# EasyEDA schematic SCH_Control_unit.json
TITLE: Sheet_1; REV: 1.0; Date: 2025-07-28; Sheet: 1/1; Drawn By: ElectroVerse; Company: Your Company
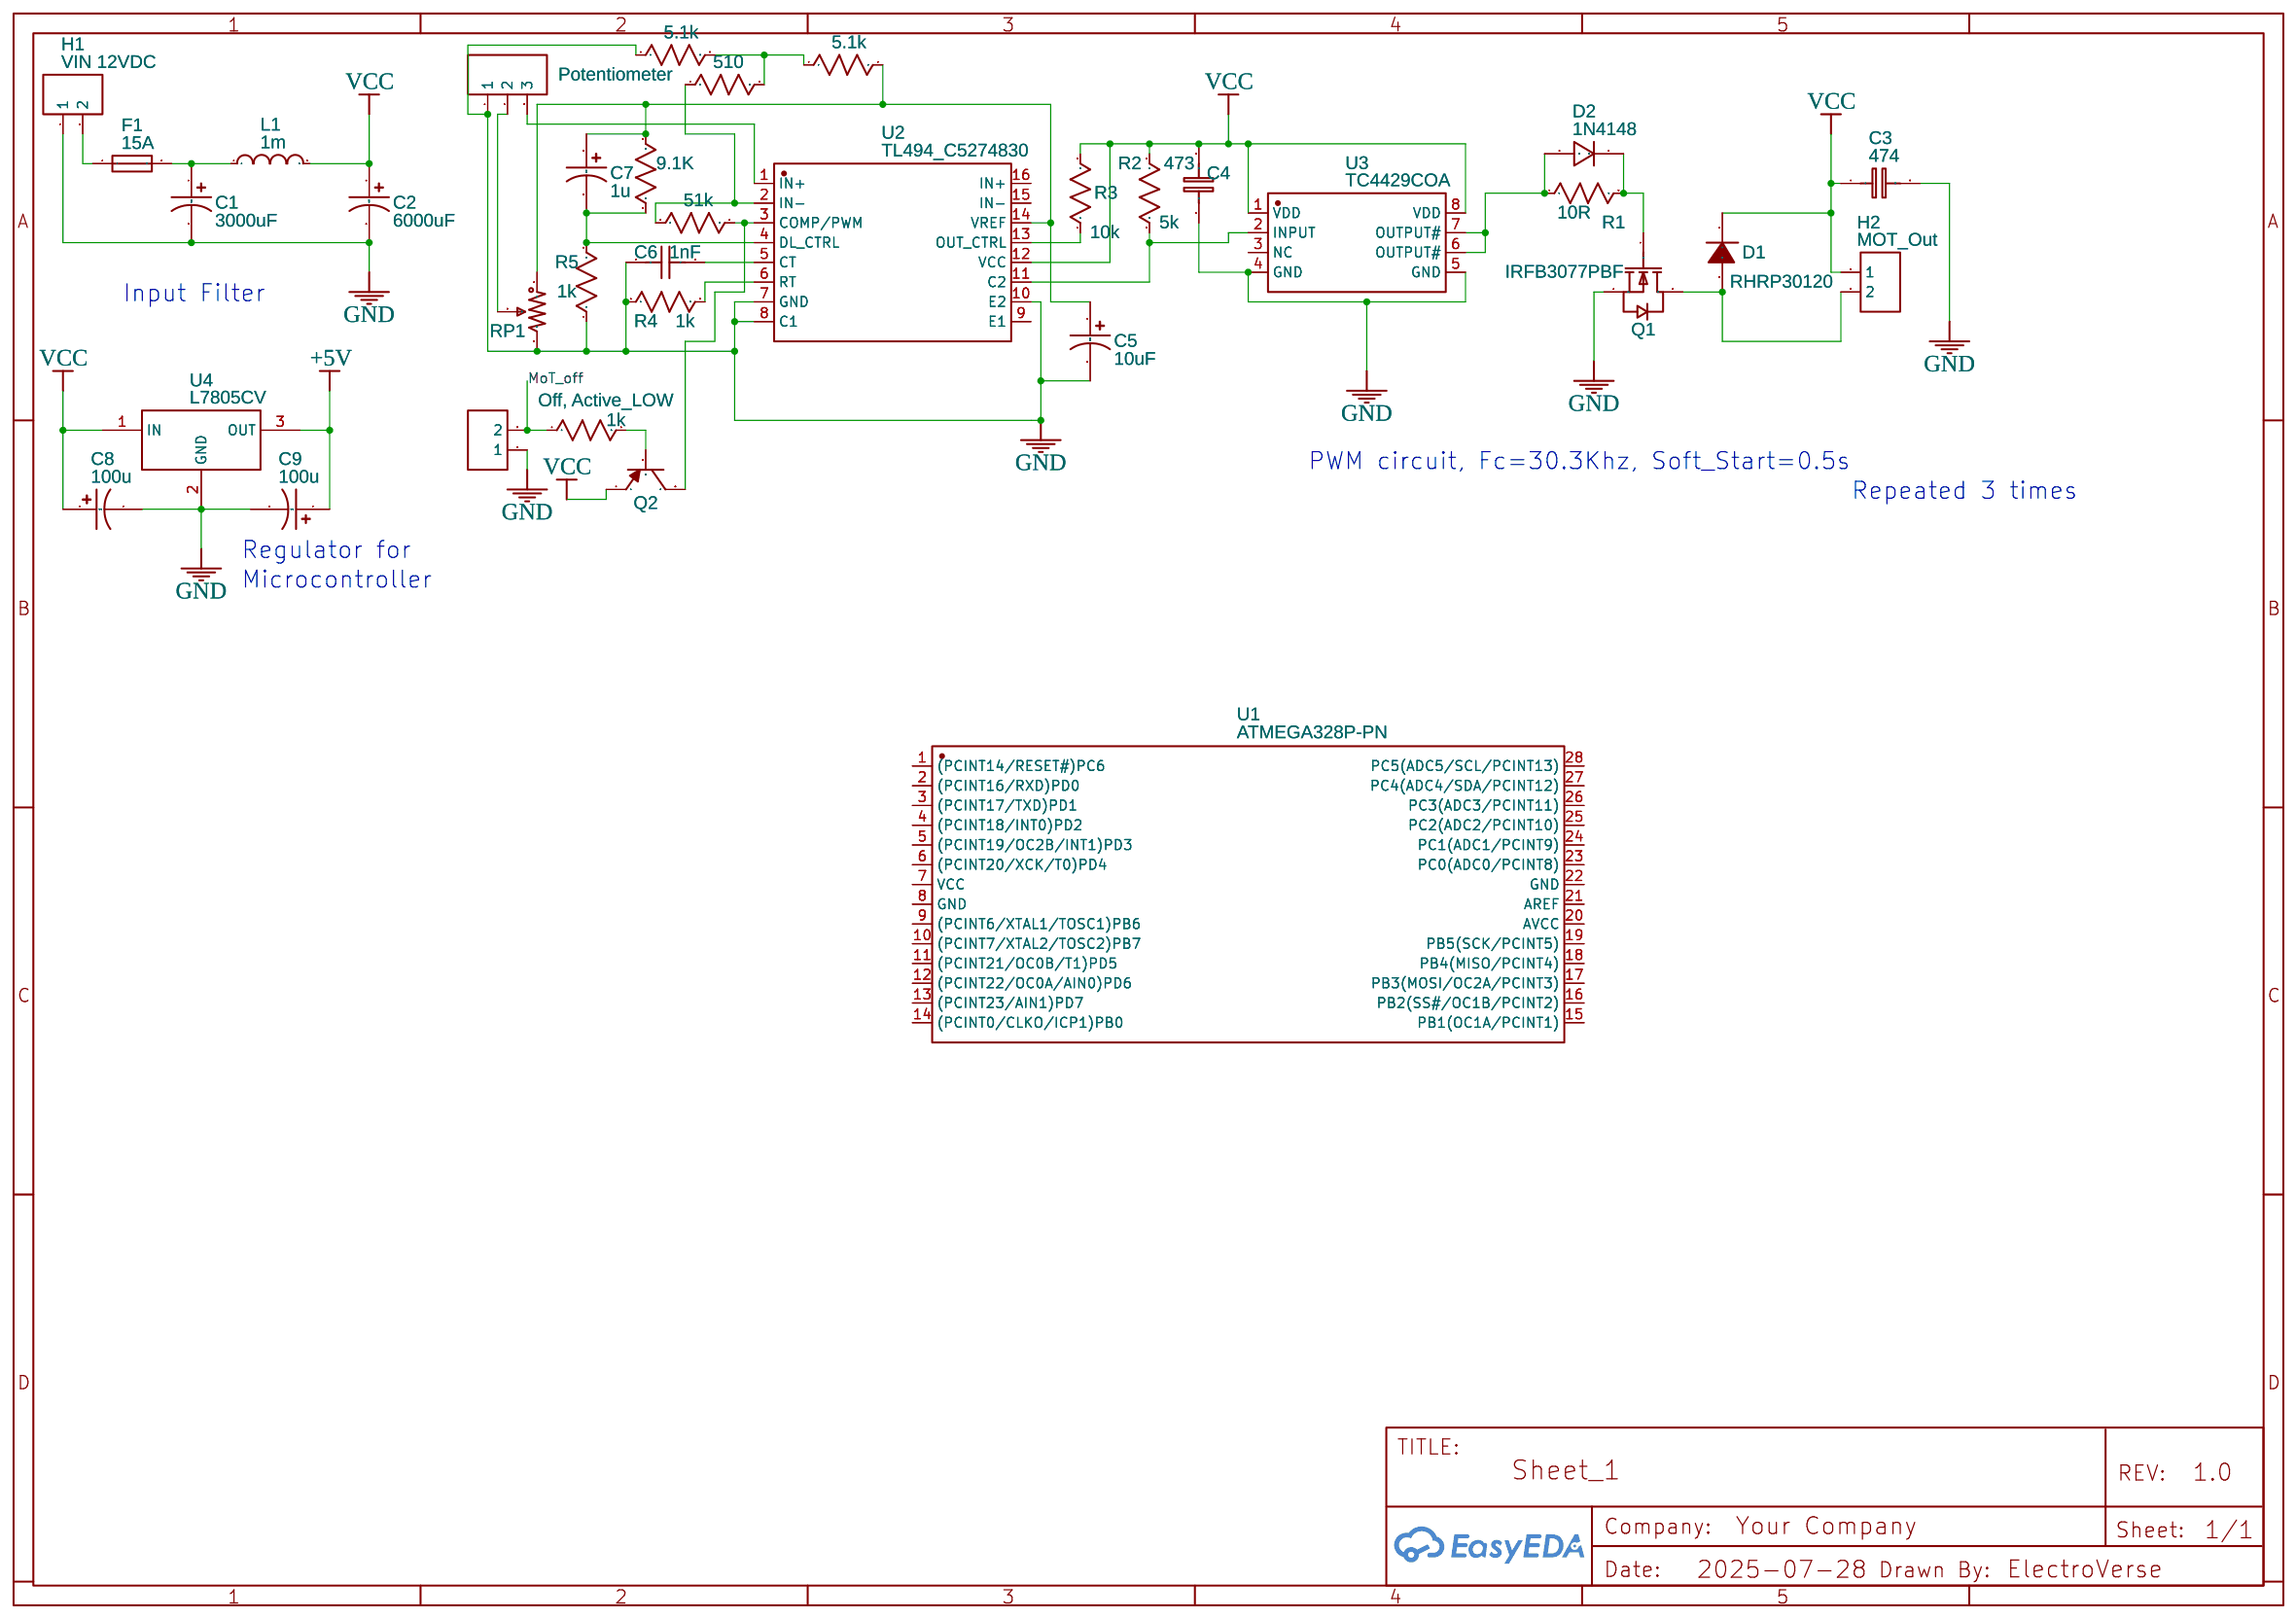
[diagram p0: schematic sheet]

## Parts
C1  3000uF  [CASE-A_3216]
C2  6000uF  [CASE-A_3216]
C3  474  [C0603]
C4  473  [C0603]
C5  10uF  [CASE-A_3216]
C6  1nF  [C0603]
C7  1u  [CASE-A_3216]
C8  100u  [CASE-A_3216]
C9  100u  [CASE-A_3216]
D1  RHRP30120  [TO-220AC_L10.0-W4.5-P5.08-L]
D2  1N4148  [DO-35_BD2.0-L4.2-P8.20-D0.5-RD]
F1  15A  [FUSE-TH_BD8.5-P5.08-D1.0]
H1  VIN 12VDC  [HDR-F-2.54_1X2]
H2  MOT_Out  [HDR-F-2.54_1X2]
H3  Potentiometer  [HDR-F-2.54_1X3]
H4  Off, Active_LOW  [HDR-F-2.54_1X2]
L1  1m  [L0603]
Q1  IRFB3077PBF  [TO-220-3_L10.0-W4.5-P2.54-L]
Q2  2N3906(TO-92)  [TO-92-3_L4.9-W3.7-P1.27-L]
R1  10R  [R0603]
R2  5k  [R0603]
R3  10k  [R0603]
R4  1k  [R0603]
R5  1k  [R0603]
R6  9.1K  [R0603]
R7  51k  [R0603]
R8  5.1k  [R0603]
R9  5.1k  [R0603]
R10  510  [R0603]
R11  1k  [R0603]
RP1  R_3386P_US  [RES-ADJ-TH_3386P]
U1  ATMEGA328P-PN  [PDIP-28_L35.0-W7.3-P2.54-LS7.8-BL]
U2  TL494_C5274830  [PDIP-16_L19.3-W6.4-P2.54-LS7.94-BL]
U3  TC4429COA  [SOIC-8_L4.9-W3.9-P1.27-LS6.0-BL]
U4  L7805CV  [TO-220-3_L10.0-W4.5-P2.54-L]

## Library data of the parts
C1 C2 C5 C7-C9 = C_Tan_SMD_A_US: Contributor: LCEDA_Lib
C3 C4 = C_0603_EU: Contributor: LCEDA_Lib
C6 = C_0603_US: Contributor: LCEDA_Lib
D1 = RHRP30120: Supplier: LCSC; Manufacturer: onsemi(安森美); Supplier Part: C11752; JLCPCB Part Class: Extended Part
D2 = 1N4148-C163750: Contributor: LCSC; Supplier Part: C163750; Supplier: LCSC; Manufacturer: FMS(美丽微); JLCPCB Part Class: Extended Part
F1 = 37000500000: Supplier: LCSC; Supplier Part: C134286; Manufacturer: Littelfuse(美国力特); Contributor: lcsc; JLCPCB Part Class: Extended Part
H1 H2 H4 = HDR-F-2.54_1x2: Supplier Part: C49661; Supplier: LCSC; Contributor: LCEDA_Lib
H3 = HDR-F-2.54_1x3: Supplier Part: C146690; Supplier: LCSC; Contributor: LCEDA_Lib
L1 = L0603_US: Contributor: LCEDA_Lib
Q1 = IRFB3077PBF: Supplier: LCSC; Manufacturer: Infineon(英飞凌); Supplier Part: C2641; JLCPCB Part Class: Extended Part
Q2 = 2N3906(TO-92): Supplier: LCSC; Manufacturer: CJ; Manufacturer Part: 2N3906; Supplier Part: C9809; Contributor: LCEDA_Lib
R1-R11 = R_0603_US: Contributor: LCEDA_Lib
RP1 = R_3386P_US: Supplier: LCSC; Contributor: LCEDA_Lib; value(Ω): 10K
U1 = ATMEGA328P-PN: Contributor: LCSC; Supplier: LCSC; Supplier Part: C1337455; Manufacturer: MICROCHIP(美国微芯); JLCPCB Part Class: Extended Part
U2 = TL494_C5274830: Contributor: lcsc; Supplier: LCSC; Supplier Part: C5274830; Manufacturer: Sungine(双竞集成); Manufacturer Part: TL494; JLCPCB Part Class: Extended Part
U3 = TC4429COA: Contributor: LCSC; Supplier: LCSC; Supplier Part: C636901; Manufacturer: MICROCHIP(美国微芯); JLCPCB Part Class: Extended Part
U4 = L7805CV_C6430948: Supplier: LCSC; Supplier Part: C6430948; Manufacturer: GOODWORK(固得沃克); Contributor: lcsc; JLCPCB Part Class: Extended Part

## Nets
+5V: C9.1 U4.3(OUT)
GND: C1.2 C2.2 C3.2 C4.1 C5.2 C6.1 C8.2 C9.2 H1.1 H3.1 H4.1 Q1.3(S) R4.1 R5.1 R8.1 RP1.3 U2.7(GND) U2.8(C1) U2.10(E2) U3.4(GND) U3.5(GND) U4.2(GND)
VCC: C2.1 C3.1 C4.2 C8.1 D1.1(A) H2.1 L1.2 Q2.1(E) R2.1 R3.2 U2.12(VCC) U3.1(VDD) U3.8(VDD) U4.1(IN)
MoT_off: H4.2 R11.1
Net-(C1-1): C1.1 F1.2 L1.1
Net-(C5-1): C5.1 C7.1 R6.2 R9.2 RP1.1 U2.14(VREF)
Net-(C6-2): C6.2 U2.5(CT)
Net-(C7-2): C7.2 R5.2 R6.1 U2.4(DL_CTRL)
Net-(D1-2): D1.2(C) H2.2 Q1.2(D)
Net-(D2-1): D2.1 Q1.1(G) R1.2
Net-(D2-2): D2.2 R1.1 U3.6(OUTPUT#) U3.7(OUTPUT#)
Net-(F1-1): F1.1 H1.2
Net-(H3-2): H3.2 RP1.2
Net-(H3-3): H3.3 U2.1(IN+)
Net-(Q2-2): Q2.2(B) R11.2
Net-(Q2-3): Q2.3(C) R7.2 U2.3(COMP/PWM)
Net-(R2-2): R2.2 U2.11(C2) U3.2(INPUT)
Net-(R3-1): R3.1 U2.13(OUT_CTRL)
Net-(R4-2): R4.2 U2.6(RT)
Net-(R7-1): R7.1 R10.1 U2.2(IN-)
Net-(R8-2): R8.2 R9.1 R10.2

Not connected (* = marked no-connect by the designer): U1 1((PCINT14/RESET#)PC6) 2((PCINT16/RXD)PD0) 3((PCINT17/TXD)PD1) 4((PCINT18/INT0)PD2) 5((PCINT19/OC2B/INT1)PD3) 6((PCINT20/XCK/T0)PD4) 7(VCC) 8(GND) 9((PCINT6/XTAL1/TOSC1)PB6) 10((PCINT7/XTAL2/TOSC2)PB7) 11((PCINT21/OC0B/T1)PD5) 12((PCINT22/OC0A/AIN0)PD6) 13((PCINT23/AIN1)PD7) 14((PCINT0/CLKO/ICP1)PB0) 15(PB1(OC1A/PCINT1)) 16(PB2(SS#/OC1B/PCINT2)) 17(PB3(MOSI/OC2A/PCINT3)) 18(PB4(MISO/PCINT4)) 19(PB5(SCK/PCINT5)) 20(AVCC) 21(AREF) 22(GND) 23(PC0(ADC0/PCINT8)) 24(PC1(ADC1/PCINT9)) 25(PC2(ADC2/PCINT10)) 26(PC3(ADC3/PCINT11)) 27(PC4(ADC4/SDA/PCINT12)) 28(PC5(ADC5/SCL/PCINT13)); U2 9(E1) 15(IN-) 16(IN+); U3 3(NC)

## Notes on the sheet
- Input Filter
- PWM circuit, Fc=30.3Khz, Soft_Start=0.5s
- Repeated 3 times
- Regulator for
- Microcontroller
